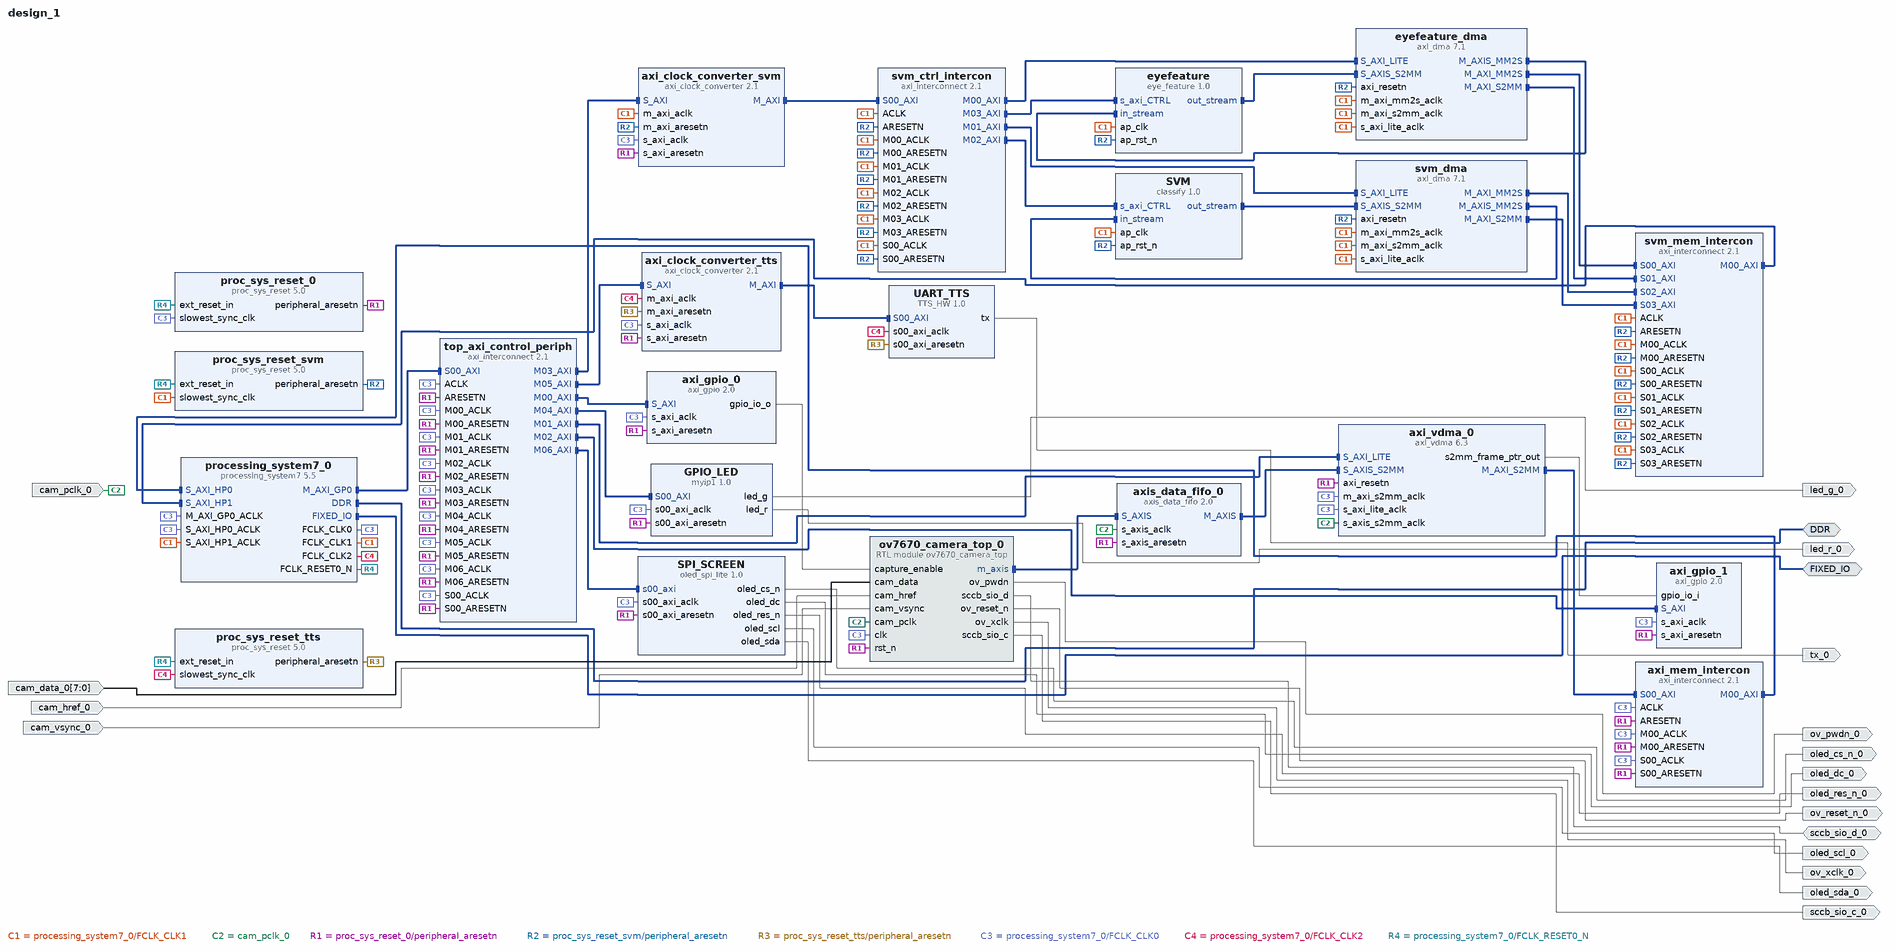
[diagram p0: block diagram of the top level]
# Vivado block design design_1, xc7z020clg400-1, Vivado 2023.2
create_bd_design design_1

create_bd_intf_port -mode Master -vlnv xilinx.com:interface:ddrx_rtl:1.0 DDR
create_bd_intf_port -mode Master -vlnv xilinx.com:display_processing_system7:fixedio_rtl:1.0 FIXED_IO
create_bd_port -dir I cam_pclk_0
create_bd_port -dir I cam_vsync_0
create_bd_port -dir I cam_href_0
create_bd_port -dir I -from 7 -to 0 cam_data_0
create_bd_port -dir O ov_xclk_0
create_bd_port -dir O ov_reset_n_0
create_bd_port -dir O ov_pwdn_0
create_bd_port -dir O sccb_sio_c_0
create_bd_port -dir IO sccb_sio_d_0
create_bd_port -dir O led_r_0
create_bd_port -dir O led_g_0
create_bd_port -dir O tx_0
create_bd_port -dir O oled_cs_n_0
create_bd_port -dir O oled_dc_0
create_bd_port -dir O oled_res_n_0
create_bd_port -dir O oled_scl_0
create_bd_port -dir O oled_sda_0

create_bd_cell -type ip -vlnv xilinx.com:ip:processing_system7:5.5 processing_system7_0
set_property -dict [list \
  CONFIG.PCW_EN_CLK1_PORT 1 \
  CONFIG.PCW_EN_CLK2_PORT 1 \
  CONFIG.PCW_FCLK_CLK1_BUF TRUE \
  CONFIG.PCW_FCLK_CLK2_BUF TRUE \
  CONFIG.PCW_FPGA0_PERIPHERAL_FREQMHZ 100 \
  CONFIG.PCW_FPGA2_PERIPHERAL_FREQMHZ 125 \
  CONFIG.PCW_FPGA_FCLK1_ENABLE 1 \
  CONFIG.PCW_FPGA_FCLK2_ENABLE 1 \
  CONFIG.PCW_USE_S_AXI_HP0 1 \
  CONFIG.PCW_USE_S_AXI_HP1 1 \
] [get_bd_cells processing_system7_0]
# 31 more settings of processing_system7_0 are not shown: defaults, MIO pin electricals, DDR timing, and values the tool derives
create_bd_cell -type ip -vlnv xilinx.com:ip:axi_vdma:6.3 axi_vdma_0
set_property -dict [list \
  CONFIG.c_include_mm2s 0 \
  CONFIG.c_num_fstores 16 \
  CONFIG.c_s2mm_linebuffer_depth 2048 \
  CONFIG.c_s2mm_max_burst_length 16 \
] [get_bd_cells axi_vdma_0]
create_bd_cell -type ip -vlnv xilinx.com:ip:axi_gpio:2.0 axi_gpio_0
set_property -dict [list \
  CONFIG.C_ALL_INPUTS_2 1 \
  CONFIG.C_ALL_OUTPUTS 1 \
  CONFIG.C_GPIO2_WIDTH 3 \
  CONFIG.C_GPIO_WIDTH 1 \
  CONFIG.C_IS_DUAL 1 \
] [get_bd_cells axi_gpio_0]
create_bd_cell -type ip -vlnv xilinx.com:ip:proc_sys_reset:5.0 proc_sys_reset_0
create_bd_cell -type module -reference ov7670_camera_top ov7670_camera_top_0
create_bd_cell -type ip -vlnv xilinx.com:ip:axi_interconnect:2.1 top_axi_control_periph
set_property -dict {CONFIG.NUM_MI 7} [get_bd_cells top_axi_control_periph]
create_bd_cell -type ip -vlnv xilinx.com:ip:axi_interconnect:2.1 axi_mem_intercon
set_property -dict {CONFIG.NUM_MI 1} [get_bd_cells axi_mem_intercon]
create_bd_cell -type ip -vlnv xilinx.com:ip:axis_data_fifo:2.0 axis_data_fifo_0
set_property -dict [list \
  CONFIG.FIFO_DEPTH 2048 \
  CONFIG.HAS_TKEEP 1 \
  CONFIG.HAS_TLAST 1 \
  CONFIG.TDATA_NUM_BYTES 4 \
  CONFIG.TUSER_WIDTH 1 \
] [get_bd_cells axis_data_fifo_0]
create_bd_cell -type ip -vlnv xilinx.com:ip:axi_gpio:2.0 axi_gpio_1
set_property -dict {CONFIG.C_ALL_INPUTS 1 CONFIG.C_GPIO_WIDTH 6} [get_bd_cells axi_gpio_1]
create_bd_cell -type ip -vlnv xilinx.com:ip:proc_sys_reset:5.0 proc_sys_reset_svm
create_bd_cell -type ip -vlnv xilinx.com:ip:axi_clock_converter:2.1 axi_clock_converter_svm
create_bd_cell -type ip -vlnv xilinx.com:user:myip1:1.0 GPIO_LED
create_bd_cell -type ip -vlnv xilinx.com:ip:proc_sys_reset:5.0 proc_sys_reset_tts
create_bd_cell -type ip -vlnv xilinx.com:user:TTS_HW:1.0 UART_TTS
create_bd_cell -type ip -vlnv xilinx.com:ip:axi_clock_converter:2.1 axi_clock_converter_tts
create_bd_cell -type ip -vlnv xilinx.com:ip:axi_dma:7.1 eyefeature_dma
set_property -dict {CONFIG.c_include_sg 0 CONFIG.c_sg_length_width 24} [get_bd_cells eyefeature_dma]
create_bd_cell -type ip -vlnv xilinx.com:ip:axi_interconnect:2.1 svm_ctrl_intercon
set_property -dict {CONFIG.NUM_MI 4} [get_bd_cells svm_ctrl_intercon]
create_bd_cell -type ip -vlnv xilinx.com:ip:axi_dma:7.1 svm_dma
set_property -dict {CONFIG.c_include_sg 0 CONFIG.c_sg_length_width 24} [get_bd_cells svm_dma]
create_bd_cell -type ip -vlnv xilinx.com:ip:axi_interconnect:2.1 svm_mem_intercon
set_property -dict {CONFIG.NUM_MI 1 CONFIG.NUM_SI 4} [get_bd_cells svm_mem_intercon]
create_bd_cell -type ip -vlnv xilinx.com:hls:eye_feature:1.0 eyefeature
create_bd_cell -type ip -vlnv xilinx.com:hls:classify:1.0 SVM
create_bd_cell -type ip -vlnv lc.local:user:oled_spi_lite:1.0 SPI_SCREEN

# ---- connections ----

connect_bd_intf_net [get_bd_intf_pins axi_clock_converter_svm/M_AXI] [get_bd_intf_pins svm_ctrl_intercon/S00_AXI]
connect_bd_intf_net [get_bd_intf_pins axi_clock_converter_tts/M_AXI] [get_bd_intf_pins UART_TTS/S00_AXI]
connect_bd_intf_net -intf_net axi_dma_0_M_AXI_MM2S [get_bd_intf_pins eyefeature_dma/M_AXI_MM2S] [get_bd_intf_pins svm_mem_intercon/S00_AXI]
connect_bd_intf_net -intf_net axi_dma_0_M_AXI_S2MM [get_bd_intf_pins eyefeature_dma/M_AXI_S2MM] [get_bd_intf_pins svm_mem_intercon/S01_AXI]
connect_bd_intf_net -intf_net axi_dma_1_M_AXI_MM2S [get_bd_intf_pins svm_dma/M_AXI_MM2S] [get_bd_intf_pins svm_mem_intercon/S02_AXI]
connect_bd_intf_net -intf_net axi_dma_1_M_AXI_S2MM [get_bd_intf_pins svm_dma/M_AXI_S2MM] [get_bd_intf_pins svm_mem_intercon/S03_AXI]
connect_bd_intf_net [get_bd_intf_pins axi_mem_intercon/M00_AXI] [get_bd_intf_pins processing_system7_0/S_AXI_HP0]
connect_bd_intf_net [get_bd_intf_pins axi_vdma_0/M_AXI_S2MM] [get_bd_intf_pins axi_mem_intercon/S00_AXI]
connect_bd_intf_net [get_bd_intf_pins axis_data_fifo_0/M_AXIS] [get_bd_intf_pins axi_vdma_0/S_AXIS_S2MM]
connect_bd_intf_net -intf_net classify_0_out_stream [get_bd_intf_pins SVM/out_stream] [get_bd_intf_pins svm_dma/S_AXIS_S2MM]
connect_bd_intf_net -intf_net eye_feature_0_out_stream [get_bd_intf_pins eyefeature_dma/S_AXIS_S2MM] [get_bd_intf_pins eyefeature/out_stream]
connect_bd_intf_net [get_bd_intf_pins eyefeature_dma/M_AXIS_MM2S] [get_bd_intf_pins eyefeature/in_stream]
connect_bd_intf_net [get_bd_intf_pins ov7670_camera_top_0/m_axis] [get_bd_intf_pins axis_data_fifo_0/S_AXIS]
connect_bd_intf_net [get_bd_intf_ports DDR] [get_bd_intf_pins processing_system7_0/DDR]
connect_bd_intf_net [get_bd_intf_ports FIXED_IO] [get_bd_intf_pins processing_system7_0/FIXED_IO]
connect_bd_intf_net [get_bd_intf_pins processing_system7_0/M_AXI_GP0] [get_bd_intf_pins top_axi_control_periph/S00_AXI]
connect_bd_intf_net [get_bd_intf_pins top_axi_control_periph/M00_AXI] [get_bd_intf_pins axi_gpio_0/S_AXI]
connect_bd_intf_net [get_bd_intf_pins svm_ctrl_intercon/M00_AXI] [get_bd_intf_pins eyefeature_dma/S_AXI_LITE]
connect_bd_intf_net [get_bd_intf_pins top_axi_control_periph/M01_AXI] [get_bd_intf_pins axi_vdma_0/S_AXI_LITE]
connect_bd_intf_net [get_bd_intf_pins svm_ctrl_intercon/M01_AXI] [get_bd_intf_pins svm_dma/S_AXI_LITE]
connect_bd_intf_net [get_bd_intf_pins top_axi_control_periph/M02_AXI] [get_bd_intf_pins axi_gpio_1/S_AXI]
connect_bd_intf_net [get_bd_intf_pins top_axi_control_periph/M03_AXI] [get_bd_intf_pins axi_clock_converter_svm/S_AXI]
connect_bd_intf_net [get_bd_intf_pins top_axi_control_periph/M04_AXI] [get_bd_intf_pins GPIO_LED/S00_AXI]
connect_bd_intf_net [get_bd_intf_pins svm_ctrl_intercon/M02_AXI] [get_bd_intf_pins SVM/s_axi_CTRL]
connect_bd_intf_net [get_bd_intf_pins eyefeature/s_axi_CTRL] [get_bd_intf_pins svm_ctrl_intercon/M03_AXI]
connect_bd_intf_net [get_bd_intf_pins svm_dma/M_AXIS_MM2S] [get_bd_intf_pins SVM/in_stream]
connect_bd_intf_net [get_bd_intf_pins processing_system7_0/S_AXI_HP1] [get_bd_intf_pins svm_mem_intercon/M00_AXI]
connect_bd_intf_net [get_bd_intf_pins top_axi_control_periph/M05_AXI] [get_bd_intf_pins axi_clock_converter_tts/S_AXI]
connect_bd_intf_net [get_bd_intf_pins SPI_SCREEN/s00_axi] [get_bd_intf_pins top_axi_control_periph/M06_AXI]
connect_bd_net [get_bd_pins GPIO_LED/led_g] [get_bd_ports led_g_0]
connect_bd_net [get_bd_pins GPIO_LED/led_r] [get_bd_ports led_r_0]
connect_bd_net [get_bd_ports sccb_sio_d_0] [get_bd_pins ov7670_camera_top_0/sccb_sio_d]
connect_bd_net -net TTS_HW_0_tx [get_bd_pins UART_TTS/tx] [get_bd_ports tx_0]
connect_bd_net -net aclk_50MHz_1 [get_bd_pins processing_system7_0/FCLK_CLK1] \
  [get_bd_pins proc_sys_reset_svm/slowest_sync_clk] [get_bd_pins axi_clock_converter_svm/m_axi_aclk] \
  [get_bd_pins processing_system7_0/S_AXI_HP1_ACLK] [get_bd_pins svm_ctrl_intercon/S00_ACLK] \
  [get_bd_pins eyefeature_dma/s_axi_lite_aclk] [get_bd_pins svm_ctrl_intercon/M00_ACLK] [get_bd_pins svm_ctrl_intercon/ACLK] \
  [get_bd_pins svm_dma/s_axi_lite_aclk] [get_bd_pins svm_ctrl_intercon/M01_ACLK] [get_bd_pins svm_ctrl_intercon/M02_ACLK] \
  [get_bd_pins svm_ctrl_intercon/M03_ACLK] [get_bd_pins eyefeature_dma/m_axi_mm2s_aclk] \
  [get_bd_pins svm_mem_intercon/S00_ACLK] [get_bd_pins svm_mem_intercon/M00_ACLK] [get_bd_pins svm_mem_intercon/ACLK] \
  [get_bd_pins eyefeature_dma/m_axi_s2mm_aclk] [get_bd_pins svm_mem_intercon/S01_ACLK] [get_bd_pins svm_dma/m_axi_mm2s_aclk] \
  [get_bd_pins svm_mem_intercon/S02_ACLK] [get_bd_pins svm_dma/m_axi_s2mm_aclk] [get_bd_pins svm_mem_intercon/S03_ACLK] \
  [get_bd_pins eyefeature/ap_clk] [get_bd_pins SVM/ap_clk]
connect_bd_net [get_bd_pins axi_gpio_0/gpio_io_o] [get_bd_pins ov7670_camera_top_0/capture_enable]
connect_bd_net [get_bd_pins axi_vdma_0/s2mm_frame_ptr_out] [get_bd_pins axi_gpio_1/gpio_io_i]
connect_bd_net -net cam_data_0_1 [get_bd_ports cam_data_0] [get_bd_pins ov7670_camera_top_0/cam_data]
connect_bd_net -net cam_href_0_1 [get_bd_ports cam_href_0] [get_bd_pins ov7670_camera_top_0/cam_href]
connect_bd_net -net cam_pclk_0_1 [get_bd_ports cam_pclk_0] \
  [get_bd_pins axi_vdma_0/s_axis_s2mm_aclk] [get_bd_pins axis_data_fifo_0/s_axis_aclk] \
  [get_bd_pins ov7670_camera_top_0/cam_pclk]
connect_bd_net -net cam_vsync_0_1 [get_bd_ports cam_vsync_0] [get_bd_pins ov7670_camera_top_0/cam_vsync]
connect_bd_net -net oled_spi_lite_0_oled_cs_n [get_bd_pins SPI_SCREEN/oled_cs_n] [get_bd_ports oled_cs_n_0]
connect_bd_net -net oled_spi_lite_0_oled_dc [get_bd_pins SPI_SCREEN/oled_dc] [get_bd_ports oled_dc_0]
connect_bd_net -net oled_spi_lite_0_oled_res_n [get_bd_pins SPI_SCREEN/oled_res_n] [get_bd_ports oled_res_n_0]
connect_bd_net -net oled_spi_lite_0_oled_scl [get_bd_pins SPI_SCREEN/oled_scl] [get_bd_ports oled_scl_0]
connect_bd_net -net oled_spi_lite_0_oled_sda [get_bd_pins SPI_SCREEN/oled_sda] [get_bd_ports oled_sda_0]
connect_bd_net [get_bd_pins ov7670_camera_top_0/ov_pwdn] [get_bd_ports ov_pwdn_0]
connect_bd_net [get_bd_pins ov7670_camera_top_0/ov_reset_n] [get_bd_ports ov_reset_n_0]
connect_bd_net [get_bd_pins ov7670_camera_top_0/ov_xclk] [get_bd_ports ov_xclk_0]
connect_bd_net [get_bd_pins ov7670_camera_top_0/sccb_sio_c] [get_bd_ports sccb_sio_c_0]
connect_bd_net [get_bd_pins proc_sys_reset_0/peripheral_aresetn] \
  [get_bd_pins top_axi_control_periph/ARESETN] [get_bd_pins top_axi_control_periph/S00_ARESETN] \
  [get_bd_pins top_axi_control_periph/M00_ARESETN] [get_bd_pins top_axi_control_periph/M01_ARESETN] \
  [get_bd_pins top_axi_control_periph/M02_ARESETN] [get_bd_pins top_axi_control_periph/M03_ARESETN] \
  [get_bd_pins top_axi_control_periph/M04_ARESETN] [get_bd_pins top_axi_control_periph/M05_ARESETN] \
  [get_bd_pins axi_gpio_1/s_axi_aresetn] [get_bd_pins axi_gpio_0/s_axi_aresetn] [get_bd_pins axis_data_fifo_0/s_axis_aresetn] \
  [get_bd_pins axi_vdma_0/axi_resetn] [get_bd_pins GPIO_LED/s00_axi_aresetn] [get_bd_pins ov7670_camera_top_0/rst_n] \
  [get_bd_pins axi_mem_intercon/ARESETN] [get_bd_pins axi_mem_intercon/S00_ARESETN] \
  [get_bd_pins axi_mem_intercon/M00_ARESETN] [get_bd_pins axi_clock_converter_svm/s_axi_aresetn] \
  [get_bd_pins axi_clock_converter_tts/s_axi_aresetn] [get_bd_pins SPI_SCREEN/s00_axi_aresetn] \
  [get_bd_pins top_axi_control_periph/M06_ARESETN]
connect_bd_net [get_bd_pins proc_sys_reset_svm/peripheral_aresetn] \
  [get_bd_pins axi_clock_converter_svm/m_axi_aresetn] [get_bd_pins svm_ctrl_intercon/ARESETN] \
  [get_bd_pins svm_ctrl_intercon/S00_ARESETN] [get_bd_pins svm_ctrl_intercon/M03_ARESETN] \
  [get_bd_pins svm_ctrl_intercon/M00_ARESETN] [get_bd_pins svm_ctrl_intercon/M01_ARESETN] \
  [get_bd_pins svm_ctrl_intercon/M02_ARESETN] [get_bd_pins eyefeature_dma/axi_resetn] [get_bd_pins svm_dma/axi_resetn] \
  [get_bd_pins svm_mem_intercon/S03_ARESETN] [get_bd_pins svm_mem_intercon/S02_ARESETN] \
  [get_bd_pins svm_mem_intercon/S01_ARESETN] [get_bd_pins svm_mem_intercon/M00_ARESETN] \
  [get_bd_pins svm_mem_intercon/S00_ARESETN] [get_bd_pins svm_mem_intercon/ARESETN] [get_bd_pins eyefeature/ap_rst_n] \
  [get_bd_pins SVM/ap_rst_n]
connect_bd_net [get_bd_pins proc_sys_reset_tts/peripheral_aresetn] \
  [get_bd_pins UART_TTS/s00_axi_aresetn] [get_bd_pins axi_clock_converter_tts/m_axi_aresetn]
connect_bd_net [get_bd_pins processing_system7_0/FCLK_CLK0] \
  [get_bd_pins processing_system7_0/M_AXI_GP0_ACLK] [get_bd_pins top_axi_control_periph/S00_ACLK] \
  [get_bd_pins proc_sys_reset_0/slowest_sync_clk] [get_bd_pins axi_gpio_0/s_axi_aclk] \
  [get_bd_pins top_axi_control_periph/M00_ACLK] [get_bd_pins top_axi_control_periph/ACLK] \
  [get_bd_pins axi_vdma_0/s_axi_lite_aclk] [get_bd_pins top_axi_control_periph/M01_ACLK] \
  [get_bd_pins axi_vdma_0/m_axi_s2mm_aclk] [get_bd_pins axi_mem_intercon/S00_ACLK] \
  [get_bd_pins processing_system7_0/S_AXI_HP0_ACLK] [get_bd_pins axi_mem_intercon/M00_ACLK] \
  [get_bd_pins axi_mem_intercon/ACLK] [get_bd_pins axi_gpio_1/s_axi_aclk] [get_bd_pins top_axi_control_periph/M02_ACLK] \
  [get_bd_pins ov7670_camera_top_0/clk] [get_bd_pins axi_clock_converter_svm/s_axi_aclk] \
  [get_bd_pins top_axi_control_periph/M03_ACLK] [get_bd_pins top_axi_control_periph/M04_ACLK] \
  [get_bd_pins GPIO_LED/s00_axi_aclk] [get_bd_pins axi_clock_converter_tts/s_axi_aclk] \
  [get_bd_pins top_axi_control_periph/M05_ACLK] [get_bd_pins SPI_SCREEN/s00_axi_aclk] \
  [get_bd_pins top_axi_control_periph/M06_ACLK]
connect_bd_net [get_bd_pins processing_system7_0/FCLK_CLK2] \
  [get_bd_pins proc_sys_reset_tts/slowest_sync_clk] [get_bd_pins axi_clock_converter_tts/m_axi_aclk] \
  [get_bd_pins UART_TTS/s00_axi_aclk]
connect_bd_net [get_bd_pins processing_system7_0/FCLK_RESET0_N] \
  [get_bd_pins proc_sys_reset_0/ext_reset_in] [get_bd_pins proc_sys_reset_svm/ext_reset_in] \
  [get_bd_pins proc_sys_reset_tts/ext_reset_in]

# ---- address map ----
assign_bd_address -offset 0x00000000 -range 512M -target_address_space [get_bd_addr_spaces axi_vdma_0/Data_S2MM] [get_bd_addr_segs processing_system7_0/S_AXI_HP0/HP0_DDR_LOWOCM]
assign_bd_address -offset 0x00000000 -range 512M -target_address_space [get_bd_addr_spaces eyefeature_dma/Data_MM2S] [get_bd_addr_segs processing_system7_0/S_AXI_HP1/HP1_DDR_LOWOCM]
assign_bd_address -offset 0x00000000 -range 512M -target_address_space [get_bd_addr_spaces eyefeature_dma/Data_S2MM] [get_bd_addr_segs processing_system7_0/S_AXI_HP1/HP1_DDR_LOWOCM]
assign_bd_address -offset 0x41200000 -range 64K -target_address_space [get_bd_addr_spaces processing_system7_0/Data] [get_bd_addr_segs axi_gpio_0/S_AXI/Reg]
assign_bd_address -offset 0x41210000 -range 64K -target_address_space [get_bd_addr_spaces processing_system7_0/Data] [get_bd_addr_segs axi_gpio_1/S_AXI/Reg]
assign_bd_address -offset 0x43000000 -range 64K -target_address_space [get_bd_addr_spaces processing_system7_0/Data] [get_bd_addr_segs axi_vdma_0/S_AXI_LITE/Reg]
assign_bd_address -offset 0x43C00000 -range 64K -target_address_space [get_bd_addr_spaces processing_system7_0/Data] [get_bd_addr_segs eyefeature/s_axi_CTRL/Reg]
assign_bd_address -offset 0x43C10000 -range 64K -target_address_space [get_bd_addr_spaces processing_system7_0/Data] [get_bd_addr_segs eyefeature_dma/S_AXI_LITE/Reg]
assign_bd_address -offset 0x43C20000 -range 64K -target_address_space [get_bd_addr_spaces processing_system7_0/Data] [get_bd_addr_segs SVM/s_axi_CTRL/Reg]
assign_bd_address -offset 0x43C30000 -range 64K -target_address_space [get_bd_addr_spaces processing_system7_0/Data] [get_bd_addr_segs svm_dma/S_AXI_LITE/Reg]
assign_bd_address -offset 0x43C40000 -range 64K -target_address_space [get_bd_addr_spaces processing_system7_0/Data] [get_bd_addr_segs GPIO_LED/S00_AXI/S00_AXI_reg]
assign_bd_address -offset 0x43C50000 -range 64K -target_address_space [get_bd_addr_spaces processing_system7_0/Data] [get_bd_addr_segs UART_TTS/S00_AXI/S00_AXI_reg]
assign_bd_address -offset 0x43C60000 -range 64K -target_address_space [get_bd_addr_spaces processing_system7_0/Data] [get_bd_addr_segs SPI_SCREEN/s00_axi/reg0]
assign_bd_address -offset 0x00000000 -range 512M -target_address_space [get_bd_addr_spaces svm_dma/Data_MM2S] [get_bd_addr_segs processing_system7_0/S_AXI_HP1/HP1_DDR_LOWOCM]
assign_bd_address -offset 0x00000000 -range 512M -target_address_space [get_bd_addr_spaces svm_dma/Data_S2MM] [get_bd_addr_segs processing_system7_0/S_AXI_HP1/HP1_DDR_LOWOCM]

validate_bd_design
save_bd_design
